# EAGLE design ramp-timebase (EAGLE 9.4.2)
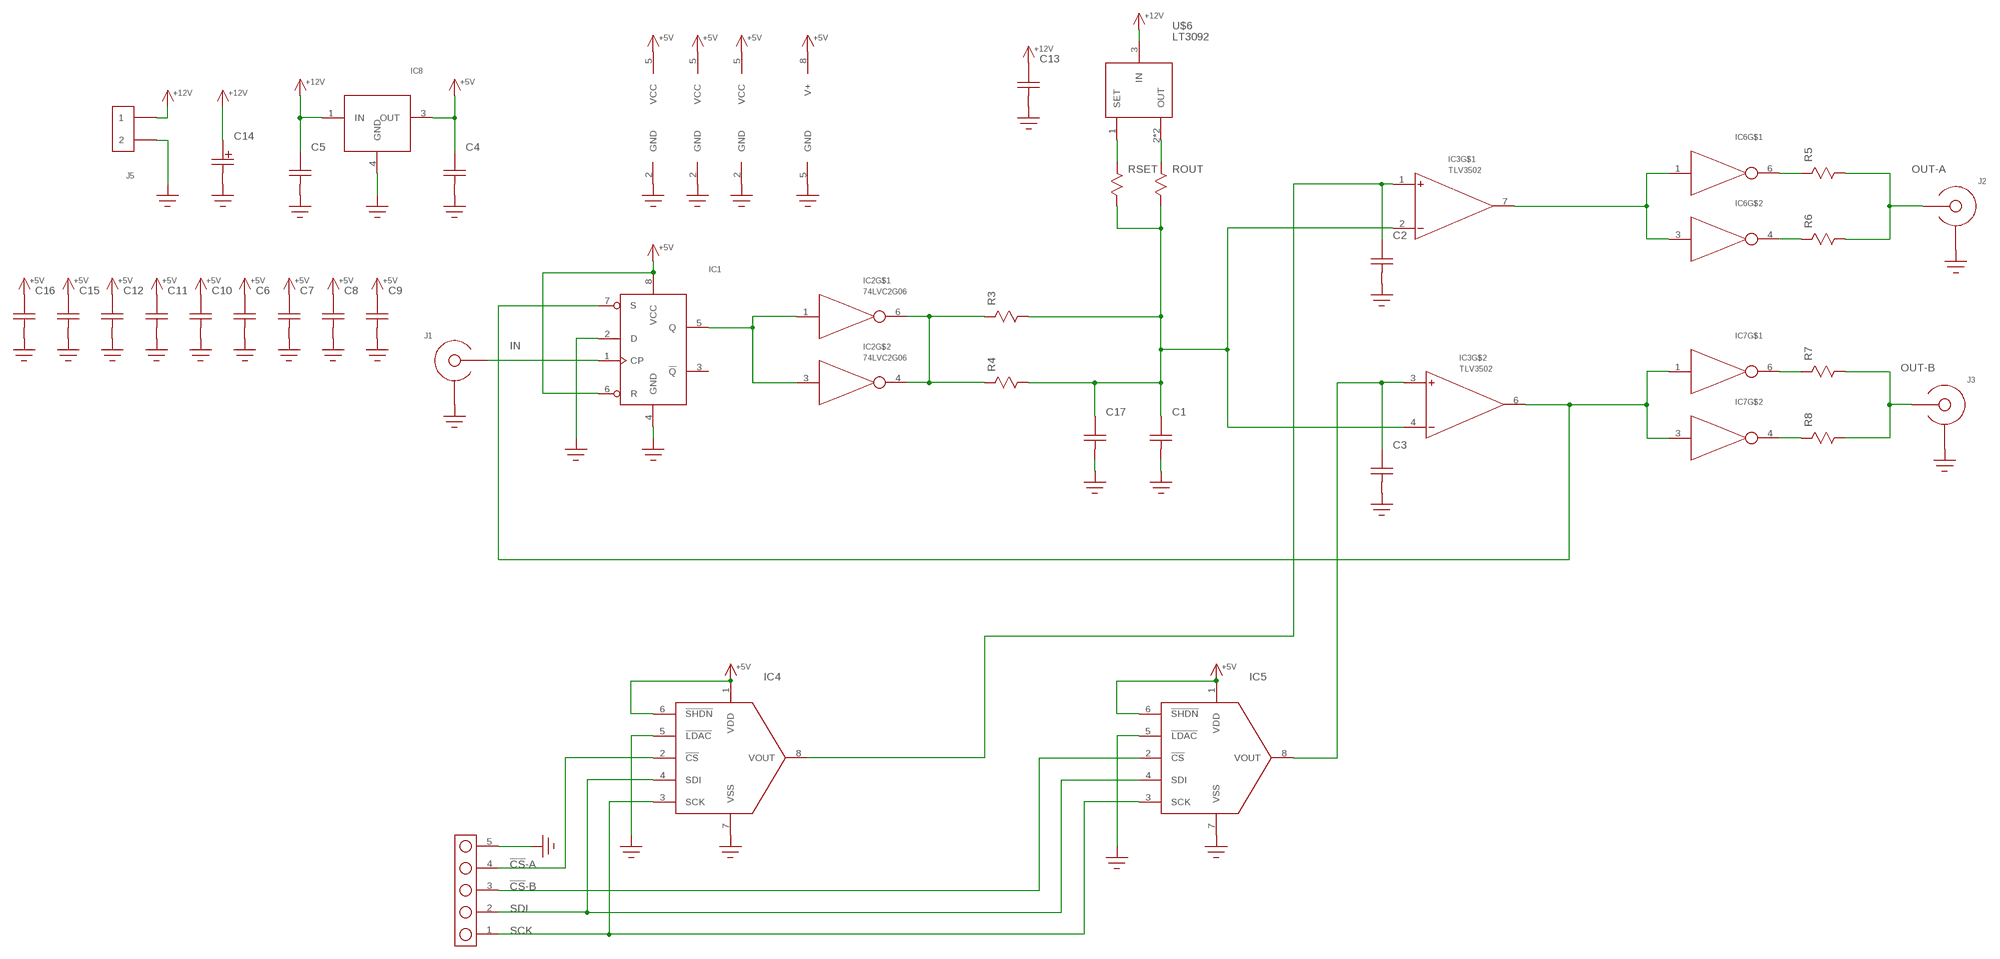
[diagram p0: schematic, sheet 1]

## Parts
C1  C0603  [C0603]
C2  C0603  [C0603]
C3  C0603  [C0603]
C4  C1206  [1206]
C5  C1206  [1206]
C6  C0603  [C0603]
C7  C0603  [C0603]
C8  C0603  [C0603]
C9  C0603  [C0603]
C10  C0603  [C0603]
C11  C0603  [C0603]
C12  C0603  [C0603]
C13  C0603  [C0603]
C14  C-POLARIZED  [CAP-E61]
C15  C0603  [C0603]
C16  C0603  [C0603]
C17  C1206  [1206]
IC1  74LVC2G74  [SSOP8]
IC2  74LVC2G06  74LVC2G04  [SOT23-6]
IC3  TLV3502  [SOIC8]
IC4  MCP48X1  [SOIC8]
IC5  MCP48X1  [SOIC8]
IC6  74LVC2G04  [SOT23-6]
IC7  74LVC2G04  [SOT23-6]
IC8  MC78M00  [DPAK]
J1  SMA-EDGE-LAUNCH4020_TAPER  [SMA_EDGE_LAUNCH_2L_4020_TAPER]
J2  SMA-EDGE-LAUNCH4020_TAPER  [SMA_EDGE_LAUNCH_2L_4020_TAPER]
J3  SMA-EDGE-LAUNCH4020_TAPER  [SMA_EDGE_LAUNCH_2L_4020_TAPER]
J4  HEADER_5PIN  [HEADER_5PIN]
J5  HEADER_2PINSCREW-TERM  [FCI_20020316_SCREW_TERM_2P]
R3  R0805  [R0805]
R4  R0805  [R0805]
R5  R1206  [R1206]
R6  R1206  [R1206]
R7  R1206  [R1206]
R8  R1206  [R1206]
ROUT  R0805  [R0805]
RSET  R0805  [R0805]
U$6  LT3092  [SOT-223]

## Nets
!CS!-A: IC4.2(!CS!) J4.4
!CS!-B: IC5.2(!CS!) J4.3
+5V: C4.P$2 C6.P$2 C7.P$2 C8.P$2 C9.P$2 C10.P$2 C11.P$2 C12.P$2 C15.P$2 C16.P$2 IC1.6(R) IC1.8(VCC) IC2.5(VCC) IC3.8(V+) IC4.1(VDD) IC4.6(!SHDN!) IC5.1(VDD) IC5.6(!SHDN!) IC6.5(VCC) IC7.5(VCC) IC8.3(OUT)
+12V: C5.P$2 C13.P$2 C14.+ IC8.1(IN) J5.P$1 U$6.3(IN)
GND: C1.P$1 C2.P$1 C3.P$1 C4.P$1 C5.P$1 C6.P$1 C7.P$1 C8.P$1 C9.P$1 C10.P$1 C11.P$1 C12.P$1 C13.P$1 C14.- C15.P$1 C16.P$1 C17.P$1 IC1.2(D) IC1.4(GND) IC2.2(GND) IC3.5(GND) IC4.5(!LDAC!) IC4.7(VSS) IC5.5(!LDAC!) IC5.7(VSS) IC6.2(GND) IC7.2(GND) IC8.4(GND) J1.BOTTOM_GND(SHIELD) J1.GND@1(SHIELD) J1.GND@2(SHIELD) J1.GND@3(SHIELD) J1.GND@4(SHIELD) J1.GND@5(SHIELD) J1.GND@6(SHIELD) J1.GND@7(SHIELD) J1.GND@8(SHIELD) J1.GND@14(SHIELD) J1.GND@15(SHIELD) J1.GND@16(SHIELD) J1.GND@17(SHIELD) J1.GND_PAD1(SHIELD) J1.GND_PAD2(SHIELD) J1.P$1(SHIELD) J1.P$2(SHIELD) J2.BOTTOM_GND(SHIELD) J2.GND@1(SHIELD) J2.GND@2(SHIELD) J2.GND@3(SHIELD) J2.GND@4(SHIELD) J2.GND@5(SHIELD) J2.GND@6(SHIELD) J2.GND@7(SHIELD) J2.GND@8(SHIELD) J2.GND@14(SHIELD) J2.GND@15(SHIELD) J2.GND@16(SHIELD) J2.GND@17(SHIELD) J2.GND_PAD1(SHIELD) J2.GND_PAD2(SHIELD) J2.P$1(SHIELD) J2.P$2(SHIELD) J3.BOTTOM_GND(SHIELD) J3.GND@1(SHIELD) J3.GND@2(SHIELD) J3.GND@3(SHIELD) J3.GND@4(SHIELD) J3.GND@5(SHIELD) J3.GND@6(SHIELD) J3.GND@7(SHIELD) J3.GND@8(SHIELD) J3.GND@14(SHIELD) J3.GND@15(SHIELD) J3.GND@16(SHIELD) J3.GND@17(SHIELD) J3.GND_PAD1(SHIELD) J3.GND_PAD2(SHIELD) J3.P$1(SHIELD) J3.P$2(SHIELD) J4.5 J5.P$2
IN: IC1.1(CP) J1.CENTER@1(CENTER)
N$1: IC1.7(S) IC3.6(OUT) IC7.1(IN) IC7.3(IN)
N$3: RSET.P$1 U$6.1(SET)
N$4: ROUT.P$1 U$6.2(OUT) U$6.4(OUT)
N$5: C2.P$2 IC3.1(+) IC4.8(VOUT)
N$6: IC1.5(Q) IC2.1(IN) IC2.3(IN)
N$7: IC2.4(OUT) IC2.6(OUT) R3.P$1 R4.P$1
N$8: C3.P$2 IC3.3(+) IC5.8(VOUT)
N$9: IC3.7(OUT) IC6.1(IN) IC6.3(IN)
N$12: IC7.4(OUT) R8.P$1
N$17: IC7.6(OUT) R7.P$1
N$18: IC6.4(OUT) R6.P$1
N$19: IC6.6(OUT) R5.P$1
N$21: C1.P$2 C17.P$2 IC3.2(-) IC3.4(-) R3.P$2 R4.P$2 ROUT.P$2 RSET.P$2
OUT-A: J2.CENTER@1(CENTER) R5.P$2 R6.P$2
OUT-B: J3.CENTER@1(CENTER) R7.P$2 R8.P$2
SCK: IC4.3(SCK) IC5.3(SCK) J4.1
SDI: IC4.4(SDI) IC5.4(SDI) J4.2
Unconnected: IC1.3(!Q!)

## Library data of the parts
C1-C13 C15-C17 = yapo:C
C14 = yapo:C-POLARIZED
IC1 = yapo:74LVC2G74
IC2 IC6 IC7 = yapo:74LVC2G04
IC3 = yapo:TLV3502
IC4 IC5 = yapo:MCP48X1
IC8 = yapo:MC78M00
J1-J3 = yapo:SMA-EDGE-LAUNCH
J4 = yapo:HEADER_5PIN
J5 = yapo:HEADER_2PIN
R3-R8 ROUT RSET = yapo:R
U$6 = yapo:LT3092

## Board
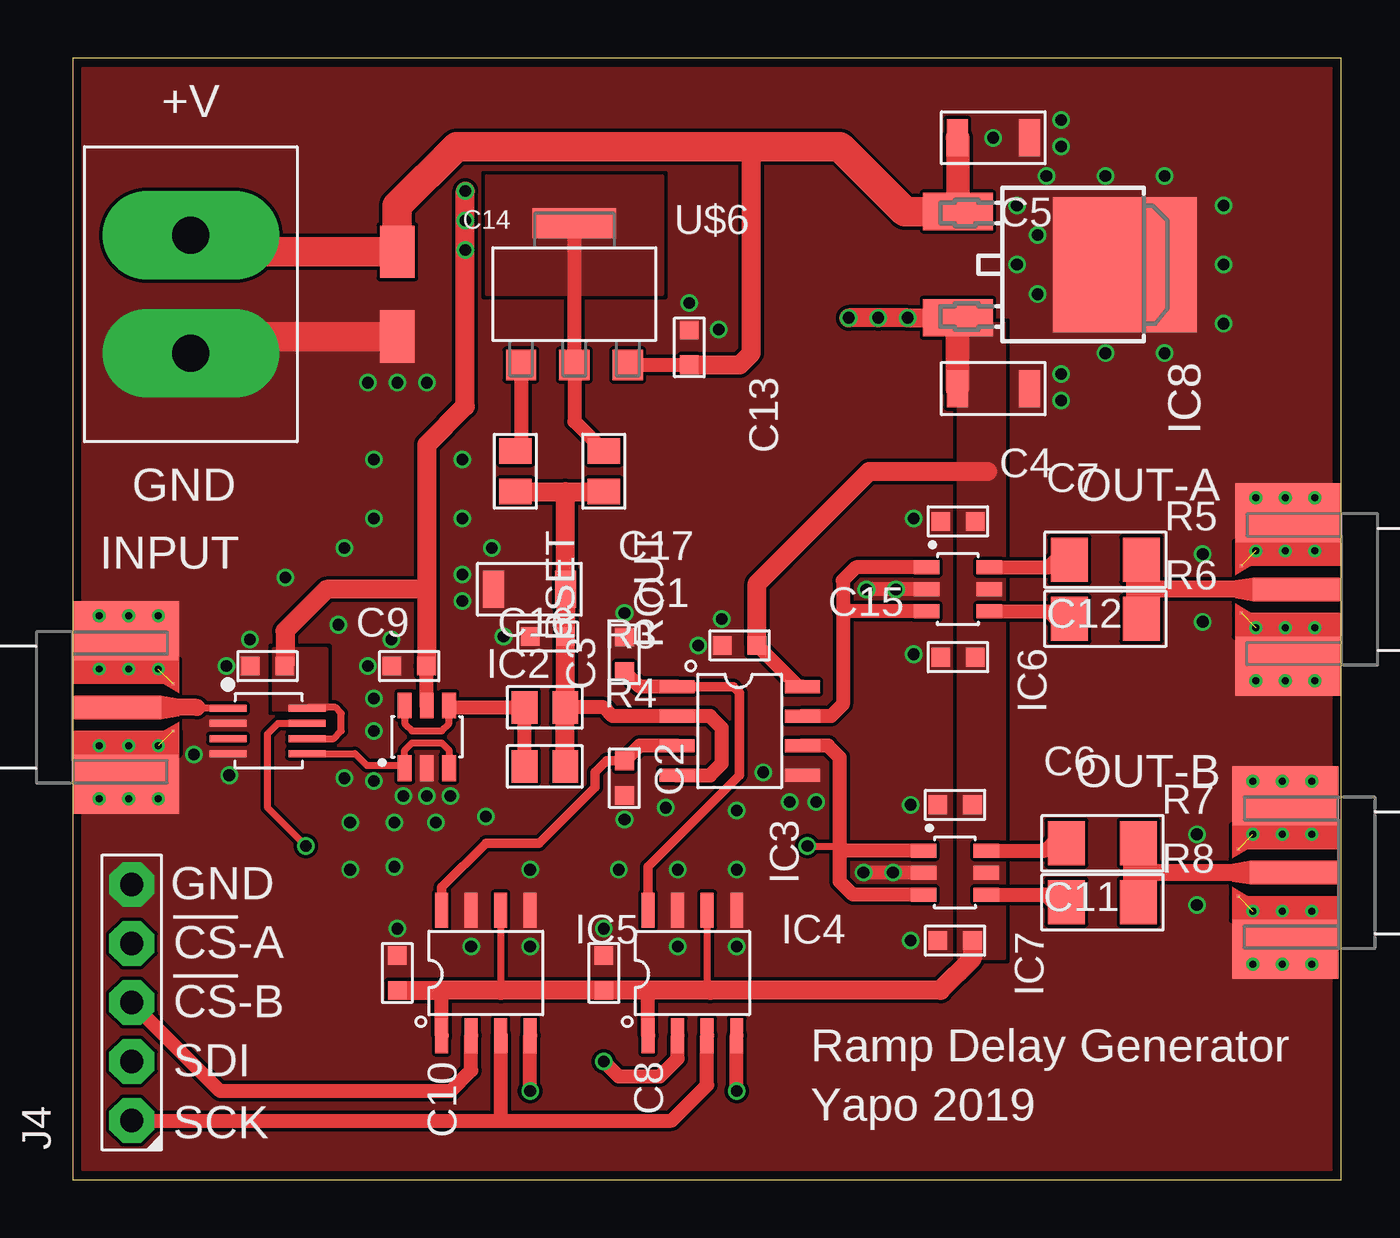
[diagram p1: board, top side]
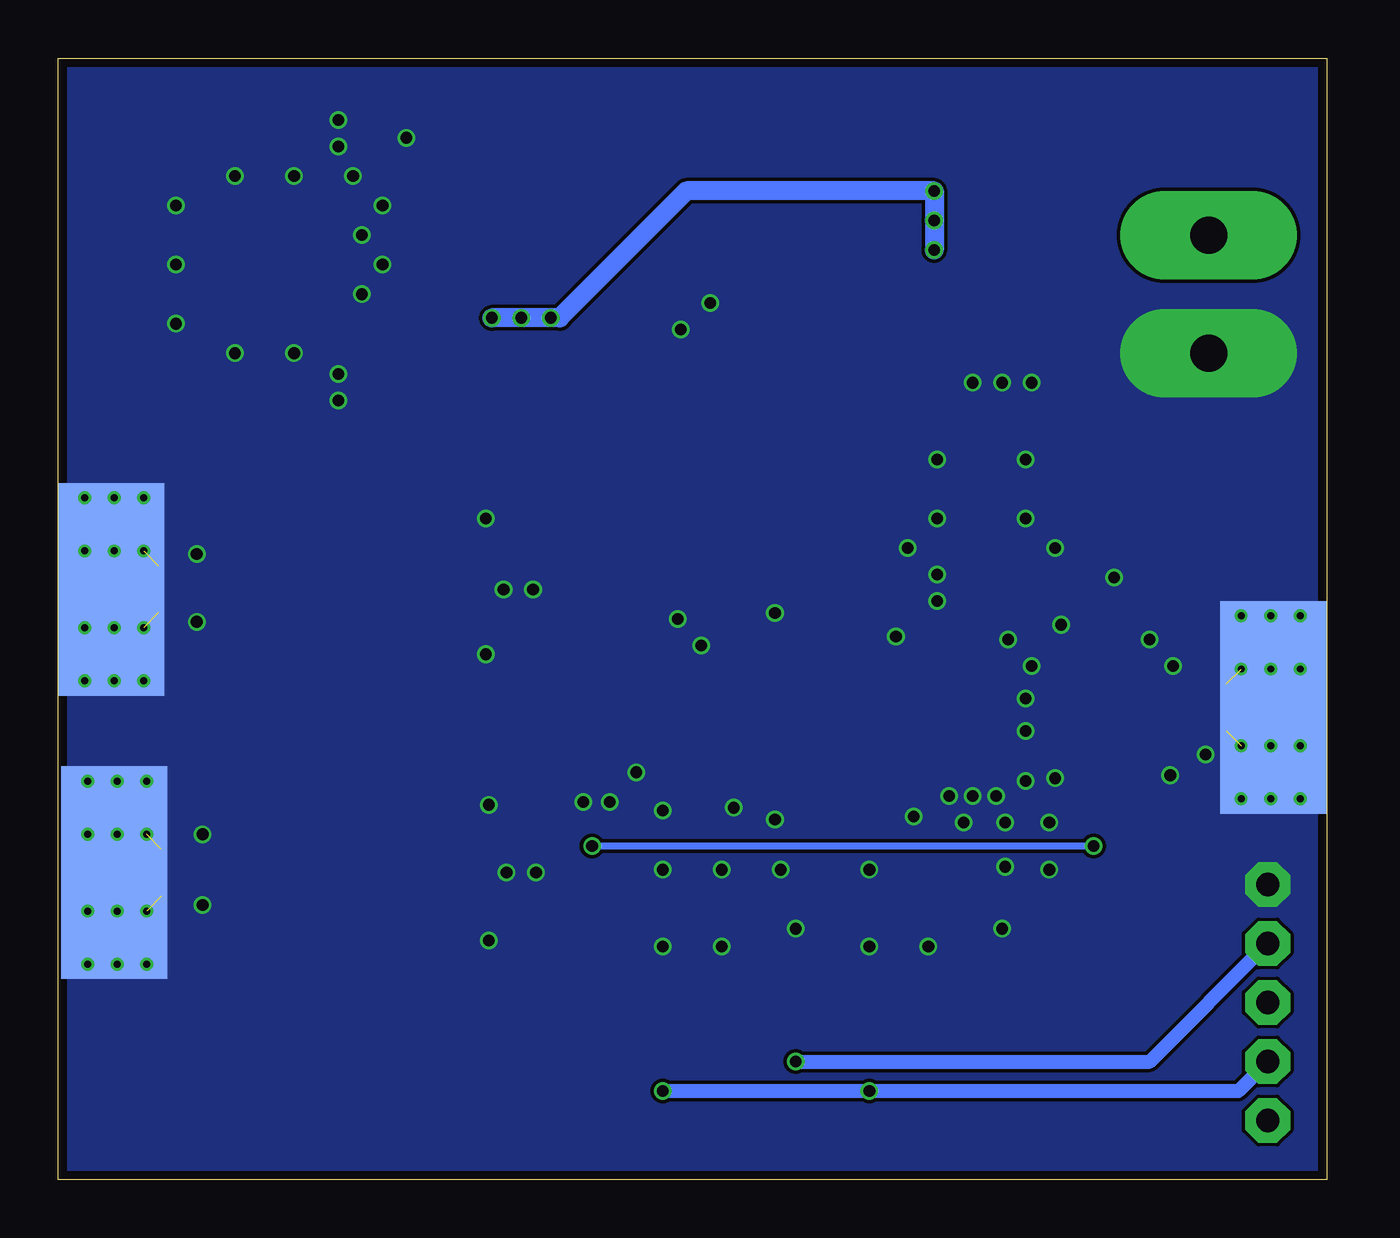
[diagram p2: board, bottom side, seen from below]

Size 54.61 x 48.26 mm. Coordinates in mm from the lower left corner, seen from the top.
Outline: 0,0 54.61,0 54.61,48.26 0,48.26 0,0
Copper layers (1*16): Top 0.035559375mm / dielectric 1.6mm / Bottom 0.035559375mm
Design rules "oshpark-2layer *": minimum track width 6mil, minimum drill 10mil, track to track 6mil, track to pad 6mil, pad to pad 6mil, via to via 6mil, smd to smd 6mil, copper to edge 15mil, drill to drill 6mil, minimum pad ring 5mil, minimum via ring 5mil, stop-mask expansion 2.5mil, vias tented up to drill 20mil, thermal gap 10mil

### Footprints (pad centres in the part's own frame; a part is rotated, then mirrored left to right if it is on the bottom)
C0603 = smd 0.8 x 0.8: P$1 -0.75,0; P$2 0.75,0
1206 = smd 0.9 x 1.6: P$1 -1.55,0; P$2 1.55,0
CAP-E61 = smd 1.5 x 2.25: + 0,1.825; - 0,-1.825
SSOP8 = smd 0.3 x 1.6: 1 -0.975,-1.7; 2 -0.325,-1.7; 3 0.325,-1.7; 4 0.975,-1.7; 5 0.975,1.7; 6 0.325,1.7; 7 -0.325,1.7; 8 -0.975,1.7
SOT23-6 = smd 0.6 x 1.1: 1 -0.95,-1.35; 2 0,-1.35; 3 0.95,-1.35; 4 0.95,1.35; 5 0,1.35; 6 -0.95,1.35
SOIC8 = smd 0.55 x 1.5: 1 -1.905,-2.7; 2 -0.635,-2.7; 3 0.635,-2.7; 4 1.905,-2.7; 5 1.905,2.7; 6 0.635,2.7; 7 -0.635,2.7; 8 -1.905,2.7
DPAK = smd 1.6 x 3: 1 -2.285,0; 3 2.285,0 | smd 5.8 x 6.2: 4 0,7.18
SMA_EDGE_LAUNCH_2L_4020_TAPER = smd 4.572 x 9.144 bottom: BOTTOM_GND 2.286,0 | smd 3.81 x 1.016: CENTER@1 1.905,0 | drill 0.3: GND@1 1.143,3.937; GND@2 3.683,3.937; GND@3 1.143,1.651; GND@4 3.683,1.651; GND@5 1.143,-1.651; GND@6 3.683,-1.651; GND@7 1.143,-3.937; GND@8 3.683,-3.937; GND@14 2.413,3.937; GND@15 2.413,-3.937; GND@16 2.413,-1.651; GND@17 2.413,1.651 | smd 4.572 x 2.54: GND_PAD1 2.286,3.302; GND_PAD2 2.286,-3.302 | smd 0.127 x 0.127: P$1 4.318,1.016; P$2 4.318,-1.016
HEADER_5PIN = drill 1 pad 1.93 octagon: 1 -5.08,0; 2 -2.54,0; 3 0,0; 4 2.54,0; 5 5.08,0
FCI_20020316_SCREW_TERM_2P = drill 1.6 pad 3.81 long: P$1 -2.54,0; P$2 2.54,0
R0805 = smd 1.1 x 1.4: P$1 -0.875,0; P$2 0.875,0
R1206 = smd 1.6 x 1.9: P$1 -1.55,0; P$2 1.55,0
SOT-223 = smd 1.3 x 1.3: 1 -2.3,-3.05; 2 0,-3.05; 3 2.3,-3.05 | smd 3.6 x 1.3: 4 0,3.05

### Placement (x,y rotation side)
C1  20.45,23.37 0 top
C2  23.75,22.61 270 top
C3  23.75,17.27 90 top
C4  39.62,34.04 180 top
C5  39.62,44.83 180 top
C6  37.97,16.13 0 top
C7  38.1,28.32 0 top
C8  22.86,8.89 270 top
C9  8.38,22.1 0 top
C10  13.97,8.89 270 top
C11  37.97,10.29 0 top
C12  38.1,22.48 0 top
C13  26.54,35.81 270 top
C14  13.97,38.1 0 top
C15  28.7,22.99 0 top
C16  14.48,22.1 0 top
C17  19.66,25.4 0 top
IC1  8.38,19.3 270 top
IC2  15.24,19.05 0 top
IC3  28.7,19.3 270 top
IC4  26.67,8.89 0 top
IC5  17.78,8.89 0 top
IC6  38.1,25.4 270 top
IC7  37.97,13.21 270 top
IC8  38.1,39.37 270 top
J1  0,20.32 0 top
J2  54.61,25.4 180 top
J3  54.48,13.21 180 top
J4  2.54,7.62 90 top
J5  5.08,38.1 270 top
R3  20.32,20.32 0 top
R4  20.32,17.78 0 top
R5  44.45,26.67 0 top
R6  44.45,24.13 0 top
R7  44.32,14.48 0 top
R8  44.32,11.94 0 top
ROUT  22.86,30.48 270 top
RSET  19.05,30.48 270 top
U$6  21.59,38.1 0 top

### Tracks (layer width: path | path; a pad name or v marks a point on that pad's centre or on a via)
!CS!-A  (via drill 0.5)
  Top 0.61: v22.86,5.08 23.5,4.45 25.27,4.45 26.04,5.21 IC4.2
  Bottom 0.61: v22.86,5.08 7.62,5.08 J4.4
!CS!-B
  Top 0.61: IC5.2 17.14,4.7 16.26,3.81 6.35,3.81 J4.3
+5V  (via drill 0.5)
  Top 0.305: IC5.6 18.41,8.14 | IC4.6 27.3,8.27 27.43,8.14 | IC1.6 11.23,18.98 11.56,19.3 11.56,20.07 11.3,20.32 10.12,20.32 IC1.8
  Top 0.61: IC3.8 31.23,21.21 C15.P$2 | IC5.1 15.88,8.01 15.75,8.14 | IC4.1 24.77,8.01 24.64,8.14 | IC2.5 15.23,20.4 C16.P$2 | C10.P$2 14.02,8.14
  Top 0.813: C15.P$2 29.45,25.64 34.29,30.48 39.37,30.48 | C11.P$2 38.72,9.51 37.35,8.14 27.43,8.14 24.64,8.14 C8.P$2 18.41,8.14 15.75,8.14 14.02,8.14 | C16.P$2 15.24,25.4 | IC8.3 v35.94,37.08 v34.67,37.08 v33.4,37.08 | 15.24,25.4 15.24,31.62 16.89,33.27 v16.89,42.55 | 15.24,25.4 10.92,25.4 9.13,23.61 C9.P$2
  Top 1.016: C4.P$2 38.07,37.06 IC8.3
  Bottom 0.813: v35.94,37.08 33.02,37.08 27.56,42.55 v16.89,42.55 v16.89,41.27 v16.89,40.01
  pour Top (no thermals): 40.13,9.53 40.13,36.83 38.1,36.83 38.1,9.53
  pour Top (no thermals): 10.92,20.19 8.64,20.19 8.64,22.86 10.92,22.86
+12V
  Top 0.61: U$6.3 23.9,35.06 C13.P$2
  Top 0.813: C13.P$2 28.71,35.06 29.21,35.56 29.21,44.45
  Top 1.016: C5.P$2 38.1,44.8 IC8.1
  Top 1.27: J5.P$1 5.79,39.92 C14.+ 13.97,41.91 16.51,44.45 29.21,44.45 33.02,44.45 35.81,41.66 IC8.1
GND  (via drill 0.5)  (6 unrouted)
  Top 0.61: IC7.2 v35.31,13.21 v34.04,13.21 | IC6.2 v35.43,25.4 v34.16,25.4
  Top 1.27: C14.- 5.79,36.27 J5.P$2
  other vias: 36.2,28.45 36.2,22.61 36.07,16.13 36.07,10.29 12.7,22.1 15.24,16.51 13.72,23.24 7.62,23.24 6.6,22.1 6.73,17.4 5.21,18.29 18.54,23.37 18.03,27.18 16.76,26.04 16.76,24.89 12.7,34.29 13.97,34.29 15.24,34.29 26.54,37.72 27.81,36.58 39.62,44.83 42.55,45.59 42.55,44.45 42.55,34.67 42.55,33.53 40.64,39.37 40.64,41.91 49.53,36.83 49.53,39.37 49.53,41.91 46.99,43.18 44.45,43.18 41.91,43.18 44.45,35.56 46.99,35.56 41.53,40.64 41.53,38.1 27.94,24.13 26.92,22.99 29.72,17.53 30.86,16.26 32,16.26 23.75,24.38 23.75,15.49 15.62,15.37 17.14,10.03 26.04,10.03 13.97,10.79 22.86,10.79 19.68,10.03 28.57,10.03 16.76,30.99 16.76,28.45 12.95,30.99 12.95,28.45 11.68,27.18 9.14,25.91 11.43,23.88 12.95,20.7 12.95,19.3 12.95,17.14 11.68,17.27 11.94,15.37 11.94,13.34 13.84,15.37 13.84,13.46 23.5,13.34 19.68,13.34 28.57,13.34 26.04,13.34 28.57,15.88 25.53,16 17.78,15.62 14.22,16.51 16.26,16.51 48.64,26.92 48.64,24 48.39,11.81 48.39,14.86
  pour Top (rank 2, no thermals): 0,0 0,48.26 54.61,48.26 54.61,0
  pour Bottom (no thermals): 0,0 0,48.26 54.61,48.26 54.61,0
IN
  Top 0.305: IC1.1 5.38,20.28 5.33,20.32
  Top 0.737: 5.33,20.32 J1.CENTER@1
N$1  (via drill 0.5)
  Top 0.305: v10.03,14.35 8.38,16 8.38,19.18 8.83,19.63 IC1.7 | v31.62,14.35 32.83,14.35 33.02,14.16
  Top 0.61: IC7.3 33.59,12.26 33.02,12.83 33.02,14.16 | 33.02,14.16 33.02,18.16 32.51,18.67 IC3.6 | IC7.1 33.02,14.16
  Bottom 0.305: v10.03,14.35 v31.62,14.35
N$3
  Top 0.61: U$6.1 19.29,31.59 RSET.P$1
N$4
  Top 0.61: ROUT.P$1 21.59,32.62 U$6.2 U$6.4
  pour Top (no thermals): 17.78,43.18 17.78,38.1 25.4,38.1 25.4,43.18
N$5
  Top 0.406: IC3.1 28.45,21.21 28.7,20.95 28.7,17.4 24.77,13.46 IC4.8
  Top 0.61: IC3.1 24.4,21.21 C2.P$2
N$6
  Top 0.305: IC2.1 14.29,17.78 | 14.29,17.78 14.29,18.48 14.61,18.8 15.88,18.8 16.19,18.48 IC2.3 | IC1.5 12.15,18.33 12.65,17.83 14.24,17.83 14.29,17.78
N$7
  Top 0.305: IC2.6 14.29,19.62 14.61,19.3 15.88,19.3 16.19,19.62 IC2.4
  Top 0.61: IC2.4 16.27,20.32 R3.P$1 R4.P$1
N$8
  Top 0.406: C3.P$2 22.98,18.02 22.48,17.53 22.48,16.89 20.07,14.48 17.78,14.48 15.88,12.57 IC5.8
  Top 0.61: IC3.3 24.4,18.67 C3.P$2
N$9
  Top 0.61: IC6.1 33.72,26.35 33.15,25.78 33.15,24.38 | 33.15,24.38 33.15,20.45 32.64,19.94 IC3.7 | IC6.3 33.21,24.45 33.15,24.38
N$12
  Top 0.61: IC7.4 41.86,12.26 42.18,11.94 R8.P$1
N$17
  Top 0.61: IC7.6 41.86,14.16 42.18,14.48 R7.P$1
N$18
  Top 0.61: IC6.4 41.99,24.45 42.31,24.13 R6.P$1
N$19
  Top 0.61: IC6.6 41.99,26.35 42.31,26.67 R5.P$1
N$21
  Top 0.61: C1.P$2 | R3.P$2 22.86,20.32 23.24,19.94 IC3.2 27.43,19.94 27.94,19.43 27.94,17.91 27.43,17.4 IC3.4
  Top 0.813: R4.P$2 R3.P$2 C1.P$2 | C1.P$2 C17.P$2 21.21,29.61 | RSET.P$2 21.21,29.61 | 21.21,29.61 ROUT.P$2
OUT-A
  Top 0.737: J2.CENTER@1 45.72,25.4 | 45.72,25.4 45.72,26.39 R5.P$2 | R6.P$2 45.72,24.41 45.72,25.4
OUT-B
  Top 0.737: J3.CENTER@1 45.59,13.21 | 45.59,13.21 45.59,14.2 R7.P$2 | R8.P$2 45.59,12.22 45.59,13.21
SCK
  Top 0.61: 18.41,2.54 25.78,2.54 27.3,4.06 IC4.3 | IC5.3 18.41,2.54 | J4.1 18.41,2.54
SDI  (via drill 0.5)
  Top 0.61: v19.68,3.81 IC5.4 | v28.57,3.81 IC4.4
  Bottom 0.61: J4.2 3.81,3.81 v19.68,3.81 v28.57,3.81

### Text on the board
tPlace: +V | GND | OUT-A | INPUT | OUT-B | GND | !CS!-A | !CS!-B | Ramp Delay Generator | SDI | Yapo 2019 | SCK